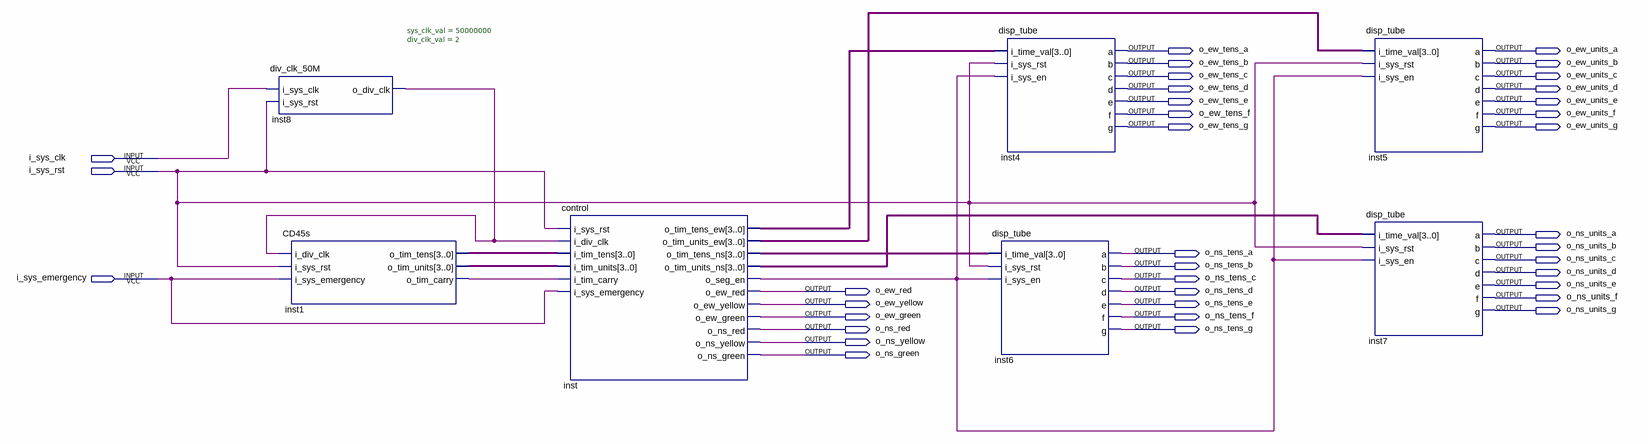
[diagram p0: schematic sheet]
// Quartus schematic TrafficLight.bdf as structural Verilog: 7 symbols, 37 pins
module TrafficLight (
  input  i_sys_clk,
  input  i_sys_rst,
  input  i_sys_emergency,
  output o_ew_tens_a,
  output o_ew_units_a,
  output o_ew_tens_b,
  output o_ew_units_b,
  output o_ew_tens_c,
  output o_ew_units_c,
  output o_ew_tens_d,
  output o_ew_units_d,
  output o_ew_tens_e,
  output o_ew_units_e,
  output o_ew_tens_f,
  output o_ew_units_f,
  output o_ew_tens_g,
  output o_ew_units_g,
  output o_ns_units_a,
  output o_ns_units_b,
  output o_ns_tens_a,
  output o_ns_units_c,
  output o_ns_tens_b,
  output o_ns_units_d,
  output o_ns_tens_c,
  output o_ns_units_e,
  output o_ew_red,
  output o_ns_tens_d,
  output o_ns_units_f,
  output o_ew_yellow,
  output o_ns_tens_e,
  output o_ns_units_g,
  output o_ew_green,
  output o_ns_tens_f,
  output o_ns_red,
  output o_ns_tens_g,
  output o_ns_yellow,
  output o_ns_green
);

  wire inst1_o_tim_carry, inst8_o_div_clk, inst_o_seg_en;
  wire [3:0] inst1_o_tim_tens, inst1_o_tim_units, inst_o_tim_tens_ew, inst_o_tim_tens_ns,
       inst_o_tim_units_ew, inst_o_tim_units_ns;

  div_clk_50M #(.sys_clk_val(50000000), .div_clk_val(2)) inst8 (
    .i_sys_clk(i_sys_clk), .i_sys_rst(i_sys_rst), .o_div_clk(inst8_o_div_clk));
  CD45s inst1 (
    .i_div_clk(inst8_o_div_clk), .i_sys_rst(i_sys_rst), .i_sys_emergency(i_sys_emergency),
    .o_tim_tens(inst1_o_tim_tens), .o_tim_units(inst1_o_tim_units), .o_tim_carry(inst1_o_tim_carry));
  control inst (
    .i_sys_rst(i_sys_rst), .i_div_clk(inst8_o_div_clk), .i_tim_tens(inst1_o_tim_tens),
    .i_tim_units(inst1_o_tim_units), .i_tim_carry(inst1_o_tim_carry), .i_sys_emergency(i_sys_emergency),
    .o_tim_tens_ew(inst_o_tim_tens_ew), .o_tim_units_ew(inst_o_tim_units_ew),
    .o_tim_tens_ns(inst_o_tim_tens_ns), .o_tim_units_ns(inst_o_tim_units_ns), .o_seg_en(inst_o_seg_en),
    .o_ew_red(o_ew_red), .o_ew_yellow(o_ew_yellow), .o_ew_green(o_ew_green), .o_ns_red(o_ns_red),
    .o_ns_yellow(o_ns_yellow), .o_ns_green(o_ns_green));
  disp_tube inst6 (
    .i_time_val(inst_o_tim_tens_ns), .i_sys_rst(i_sys_rst), .i_sys_en(inst_o_seg_en), .a(o_ns_tens_a),
    .b(o_ns_tens_b), .c(o_ns_tens_c), .d(o_ns_tens_d), .e(o_ns_tens_e), .f(o_ns_tens_f), .g(o_ns_tens_g));
  disp_tube inst4 (
    .i_time_val(inst_o_tim_tens_ew), .i_sys_rst(i_sys_rst), .i_sys_en(inst_o_seg_en), .a(o_ew_tens_a),
    .b(o_ew_tens_b), .c(o_ew_tens_c), .d(o_ew_tens_d), .e(o_ew_tens_e), .f(o_ew_tens_f), .g(o_ew_tens_g));
  disp_tube inst5 (
    .i_time_val(inst_o_tim_units_ew), .i_sys_rst(i_sys_rst), .i_sys_en(inst_o_seg_en), .a(o_ew_units_a),
    .b(o_ew_units_b), .c(o_ew_units_c), .d(o_ew_units_d), .e(o_ew_units_e), .f(o_ew_units_f), .g(o_ew_units_g));
  disp_tube inst7 (
    .i_time_val(inst_o_tim_units_ns), .i_sys_rst(i_sys_rst), .i_sys_en(inst_o_seg_en), .a(o_ns_units_a),
    .b(o_ns_units_b), .c(o_ns_units_c), .d(o_ns_units_d), .e(o_ns_units_e), .f(o_ns_units_f), .g(o_ns_units_g));
endmodule
